# EAGLE design MDM_V3_Connectorx6_A (EAGLE 6.4)
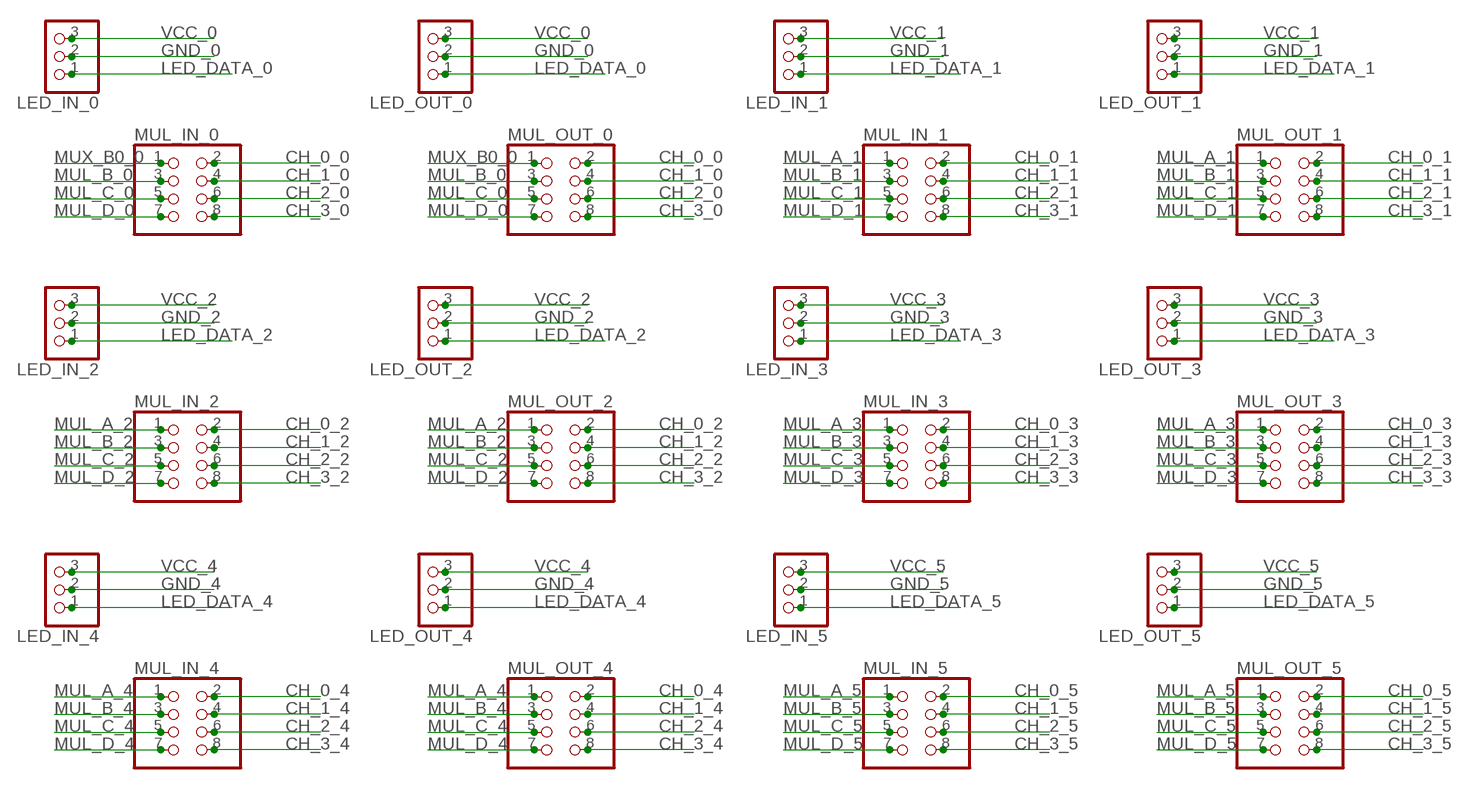
[diagram p0: schematic, sheet 1]

## Parts
LED_IN_0  PINHD-1X3  [1X03]
LED_IN_1  PINHD-1X3  [1X03]
LED_IN_2  PINHD-1X3  [1X03]
LED_IN_3  PINHD-1X3  [1X03]
LED_IN_4  PINHD-1X3  [1X03]
LED_IN_5  PINHD-1X3  [1X03]
LED_OUT_0  PINHD-1X3  [1X03]
LED_OUT_1  PINHD-1X3  [1X03]
LED_OUT_2  PINHD-1X3  [1X03]
LED_OUT_3  PINHD-1X3  [1X03]
LED_OUT_4  PINHD-1X3  [1X03]
LED_OUT_5  PINHD-1X3  [1X03]
MUL_IN_0  PINHD-2X4  [2X04]
MUL_IN_1  PINHD-2X4  [2X04]
MUL_IN_2  PINHD-2X4  [2X04]
MUL_IN_3  PINHD-2X4  [2X04]
MUL_IN_4  PINHD-2X4  [2X04]
MUL_IN_5  PINHD-2X4  [2X04]
MUL_OUT_0  PINHD-2X4  [2X04]
MUL_OUT_1  PINHD-2X4  [2X04]
MUL_OUT_2  PINHD-2X4  [2X04]
MUL_OUT_3  PINHD-2X4  [2X04]
MUL_OUT_4  PINHD-2X4  [2X04]
MUL_OUT_5  PINHD-2X4  [2X04]

## Nets
CH_0_0: MUL_IN_0.2 MUL_OUT_0.2
CH_0_1: MUL_IN_1.2 MUL_OUT_1.2
CH_0_2: MUL_IN_2.2 MUL_OUT_2.2
CH_0_3: MUL_IN_3.2 MUL_OUT_3.2
CH_0_4: MUL_IN_4.2 MUL_OUT_4.2
CH_0_5: MUL_IN_5.2 MUL_OUT_5.2
CH_1_0: MUL_IN_0.4 MUL_OUT_0.4
CH_1_1: MUL_IN_1.4 MUL_OUT_1.4
CH_1_2: MUL_IN_2.4 MUL_OUT_2.4
CH_1_3: MUL_IN_3.4 MUL_OUT_3.4
CH_1_4: MUL_IN_4.4 MUL_OUT_4.4
CH_1_5: MUL_IN_5.4 MUL_OUT_5.4
CH_2_0: MUL_IN_0.6 MUL_OUT_0.6
CH_2_1: MUL_IN_1.6 MUL_OUT_1.6
CH_2_2: MUL_IN_2.6 MUL_OUT_2.6
CH_2_3: MUL_IN_3.6 MUL_OUT_3.6
CH_2_4: MUL_IN_4.6 MUL_OUT_4.6
CH_2_5: MUL_IN_5.6 MUL_OUT_5.6
CH_3_0: MUL_IN_0.8 MUL_OUT_0.8
CH_3_1: MUL_IN_1.8 MUL_OUT_1.8
CH_3_2: MUL_IN_2.8 MUL_OUT_2.8
CH_3_3: MUL_IN_3.8 MUL_OUT_3.8
CH_3_4: MUL_IN_4.8 MUL_OUT_4.8
CH_3_5: MUL_IN_5.8 MUL_OUT_5.8
GND_0 [GND]: LED_IN_0.2 LED_OUT_0.2
GND_1 [GND]: LED_IN_1.2 LED_OUT_1.2
GND_2 [GND]: LED_IN_2.2 LED_OUT_2.2
GND_3 [GND]: LED_IN_3.2 LED_OUT_3.2
GND_4 [GND]: LED_IN_4.2 LED_OUT_4.2
GND_5 [GND]: LED_IN_5.2 LED_OUT_5.2
LED_DATA_0: LED_IN_0.1 LED_OUT_0.1
LED_DATA_1: LED_IN_1.1 LED_OUT_1.1
LED_DATA_2: LED_IN_2.1 LED_OUT_2.1
LED_DATA_3: LED_IN_3.1 LED_OUT_3.1
LED_DATA_4: LED_IN_4.1 LED_OUT_4.1
LED_DATA_5: LED_IN_5.1 LED_OUT_5.1
MUL_A_1: MUL_IN_1.1 MUL_OUT_1.1
MUL_A_2: MUL_IN_2.1 MUL_OUT_2.1
MUL_A_3: MUL_IN_3.1 MUL_OUT_3.1
MUL_A_4: MUL_IN_4.1 MUL_OUT_4.1
MUL_A_5: MUL_IN_5.1 MUL_OUT_5.1
MUL_B_0: MUL_IN_0.3 MUL_OUT_0.3
MUL_B_1: MUL_IN_1.3 MUL_OUT_1.3
MUL_B_2: MUL_IN_2.3 MUL_OUT_2.3
MUL_B_3: MUL_IN_3.3 MUL_OUT_3.3
MUL_B_4: MUL_IN_4.3 MUL_OUT_4.3
MUL_B_5: MUL_IN_5.3 MUL_OUT_5.3
MUL_C_0: MUL_IN_0.5 MUL_OUT_0.5
MUL_C_1: MUL_IN_1.5 MUL_OUT_1.5
MUL_C_2: MUL_IN_2.5 MUL_OUT_2.5
MUL_C_3: MUL_IN_3.5 MUL_OUT_3.5
MUL_C_4: MUL_IN_4.5 MUL_OUT_4.5
MUL_C_5: MUL_IN_5.5 MUL_OUT_5.5
MUL_D_0: MUL_IN_0.7 MUL_OUT_0.7
MUL_D_1: MUL_IN_1.7 MUL_OUT_1.7
MUL_D_2: MUL_IN_2.7 MUL_OUT_2.7
MUL_D_3: MUL_IN_3.7 MUL_OUT_3.7
MUL_D_4: MUL_IN_4.7 MUL_OUT_4.7
MUL_D_5: MUL_IN_5.7 MUL_OUT_5.7
MUX_B0_0: MUL_IN_0.1 MUL_OUT_0.1
VCC_0 [GND]: LED_IN_0.3 LED_OUT_0.3
VCC_1 [GND]: LED_IN_1.3 LED_OUT_1.3
VCC_2 [GND]: LED_IN_2.3 LED_OUT_2.3
VCC_3 [GND]: LED_IN_3.3 LED_OUT_3.3
VCC_4 [GND]: LED_IN_4.3 LED_OUT_4.3
VCC_5 [GND]: LED_IN_5.3 LED_OUT_5.3

## Library data of the parts
LED_IN_0 LED_IN_1-LED_IN_5 LED_OUT_0 LED_OUT_1-LED_OUT_5 = adafruit:PINHD-1X3: PIN HEADER
MUL_IN_0 MUL_IN_1-MUL_IN_5 MUL_OUT_0 MUL_OUT_1-MUL_OUT_5 = pinhead:PINHD-2X4: PIN HEADER

## Net classes
1 GND: width 0.762 mm, clearance 0.254 mm

## Board
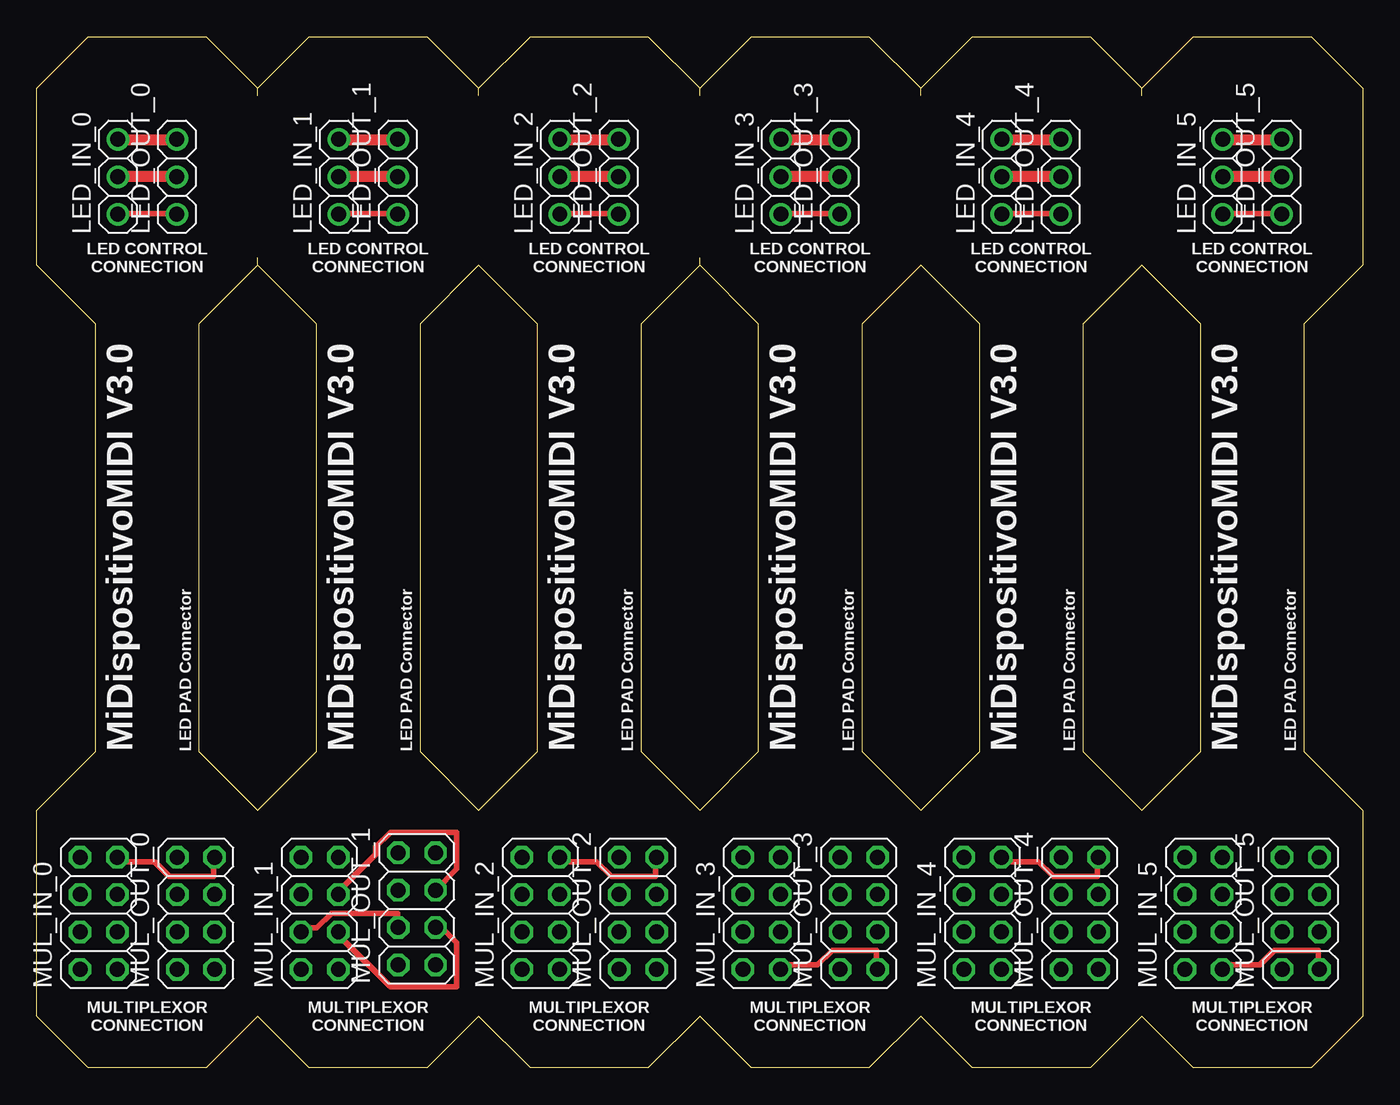
[diagram p1: board, top side]
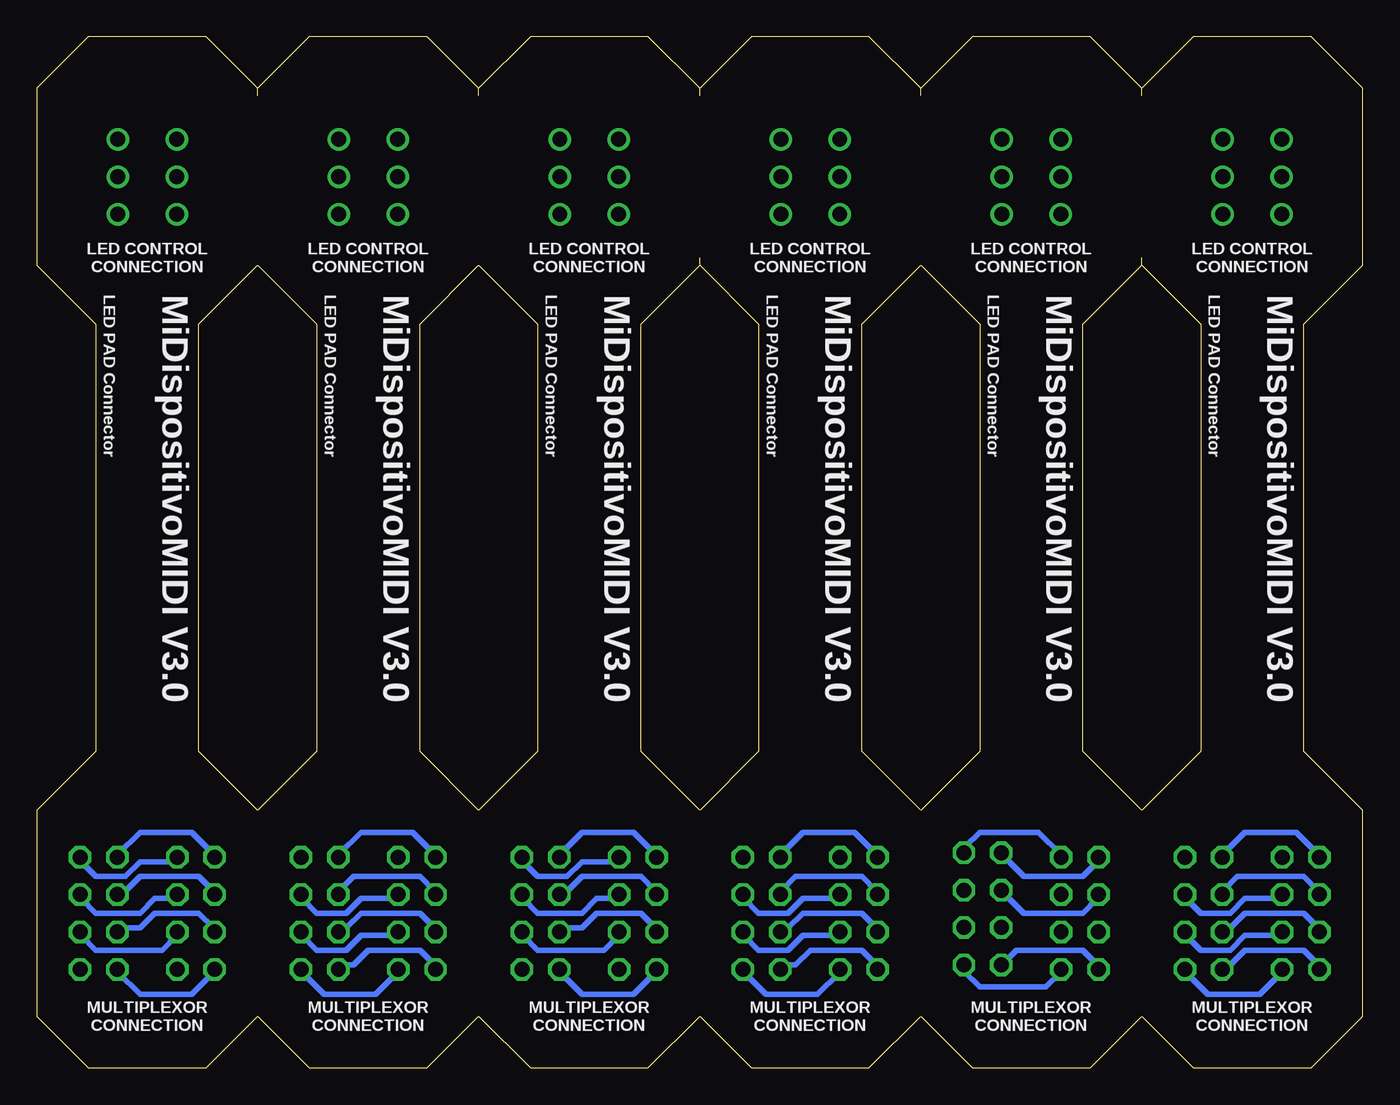
[diagram p2: board, bottom side, seen from below]

Size 90 x 70 mm. Coordinates in mm from the lower left corner, seen from the top.
Outline: 15,66.5 11.5,70 3.5,70 0,66.5 0,66 0,55 0,54.5 4,50.5 4,21.5 0,17.5 0,3.5 3.5,0 11.5,0 15,3.5 18.5,0 26.5,0 30,3.5 33.5,0 41.5,0 45,3.5 48.5,0 56.5,0 60,3.5 63.5,0 71.5,0 75,3.5 78.5,0 86.5,0 90,3.5 90,17.5 86,21.5 86,50.5 90,54.5 90,66.5 86.5,70 78.5,70 75,66.5
Outline: 15,54.5 11,50.5 11,21.5 15,17.5 19,21.5 19,50.5 15,54.5
Outline: 15,66 15,66.5
Outline: 15,66.5 18.5,70 26.5,70 30,66.5
Outline: 15,54.5 15,55
Outline: 30,66 30,66.5
Outline: 30,66.5 33.5,70 41.5,70 45,66.5
Outline: 45,54.5 41,50.5 41,21.5 45,17.5 49,21.5 49,50.5 45,54.5
Outline: 45,66 45,66.5
Outline: 45,66.5 48.5,70 56.5,70 60,66.5
Outline: 45,54.5 45,55
Outline: 60,66 60,66.5
Outline: 60,66.5 63.5,70 71.5,70 75,66.5
Outline: 75,66 75,66.5
Outline: 30,54.5 26,50.5 26,21.5 30,17.5 34,21.5 34,50.5 30,54.5
Outline: 60,54.5 56,50.5 56,21.5 60,17.5 64,21.5 64,50.5 60,54.5
Outline: 75,54.5 71,50.5 71,21.5 75,17.5 79,21.5 79,50.5 75,54.5
Copper layers (1*16): Top 0.035mm / dielectric 1.5mm / Bottom 0.035mm
Design rules "default *": minimum track width 15mil, minimum drill 24mil, track to track 10mil, track to pad 10mil, pad to pad 10mil, via to via 10mil, smd to smd 8mil, copper to edge 8mil, drill to drill 8mil, minimum pad ring 10mil, minimum via ring 10mil, stop-mask expansion 4mil, vias tented up to drill 0mil, thermal gap 10mil
tKeepout: area 2,5.5 to 6.5,15.5; area 8.5,5.5 to 13,15.5
tRestrict: 10 lines
bRestrict: 10 lines

### Footprints (pad centres in the part's own frame; a part is rotated, then mirrored left to right if it is on the bottom)
1X03 = drill 1.016: 1 -2.54,0; 2 0,0; 3 2.54,0
2X04 = drill 1.016 octagon: 1 -3.81,-1.27; 2 -3.81,1.27; 3 -1.27,-1.27; 4 -1.27,1.27; 5 1.27,-1.27; 6 1.27,1.27; 7 3.81,-1.27; 8 3.81,1.27

### Placement (x,y rotation side)
LED_IN_0  5.5,60.5 90 top
LED_IN_1  20.5,60.5 90 top
LED_IN_2  35.5,60.5 90 top
LED_IN_3  50.5,60.5 90 top
LED_IN_4  65.5,60.5 90 top
LED_IN_5  80.5,60.5 90 top
LED_OUT_0  9.5,60.5 90 top
LED_OUT_1  24.5,60.5 90 top
LED_OUT_2  39.5,60.5 90 top
LED_OUT_3  54.5,60.5 90 top
LED_OUT_4  69.5,60.5 90 top
LED_OUT_5  84.5,60.5 90 top
MUL_IN_0  4.2,10.5 90 top
MUL_IN_1  19.2,10.5 90 top
MUL_IN_2  34.2,10.5 90 top
MUL_IN_3  49.2,10.5 90 top
MUL_IN_4  64.2,10.5 90 top
MUL_IN_5  79.2,10.5 90 top
MUL_OUT_0  10.8,10.5 90 top
MUL_OUT_1  25.8,10.8 90 top
MUL_OUT_2  40.8,10.5 90 top
MUL_OUT_3  55.8,10.5 90 top
MUL_OUT_4  70.8,10.5 90 top
MUL_OUT_5  85.8,10.5 90 top

### Tracks (layer width: path | path; a pad name or v marks a point on that pad's centre or on a via)
CH_0_0
  Bottom 0.381: MUL_IN_0.2 3,7 4,8 8,8 9,7 9.5,7 MUL_OUT_0.2
CH_0_1
  Bottom 0.381: MUL_IN_1.2 18,7 19,8 23.5,8 24.5,7 MUL_OUT_1.2
CH_0_2
  Bottom 0.381: MUL_IN_2.2 33,7 34,8 37.5,8 38.5,7 39.5,7 MUL_OUT_2.2
CH_0_3
  Bottom 0.381: MUL_IN_3.2 48,6.5 49.5,5 53,5 54.5,6.5 MUL_OUT_3.2
CH_0_4
  Bottom 0.381: MUL_IN_4.2 63,7 64,8 67.5,8 68.5,7 69.5,7 MUL_OUT_4.2
CH_0_5
  Bottom 0.381: MUL_IN_5.2 78,6.5 79.5,5 83,5 84.5,6.5 MUL_OUT_5.2
CH_1_0
  Bottom 0.381: MUL_IN_0.4 3,9.5 4,10.5 8,10.5 9,9.5 9.5,9.5 MUL_OUT_0.4
CH_1_1
  Top 0.381: MUL_IN_1.4 18,9.5 19,9.5 20,10.5 24.5,10.5 24.5,10 MUL_OUT_1.4
CH_1_2
  Bottom 0.381: MUL_IN_2.4 33,9.5 34,10.5 38,10.5 39,9.5 39.5,9.5 MUL_OUT_2.4
CH_1_3
  Bottom 0.381: MUL_IN_3.4 48,9.5 49,10.5 52,10.5 53,9.5 54.5,9.5 MUL_OUT_3.4
CH_1_4
  Bottom 0.381: MUL_IN_4.4 63,9.5 64,10.5 68,10.5 69,9.5 69.5,9.5 MUL_OUT_4.4
CH_1_5
  Bottom 0.381: MUL_IN_5.4 78,9.5 79,10.5 82,10.5 83,9.5 84.5,9.5 MUL_OUT_5.4
CH_2_0
  Bottom 0.381: MUL_IN_0.6 3,12 4,13 8.5,13 9.5,12 MUL_OUT_0.6
CH_2_1
  Bottom 0.381: MUL_IN_1.6 18,11.5 19,10.5 23,10.5 24.5,12 MUL_OUT_1.6
CH_2_2
  Bottom 0.381: MUL_IN_2.6 33,12 34,13 38.5,13 39.5,12 MUL_OUT_2.6
CH_2_3
  Bottom 0.381: MUL_IN_3.6 48,12 49,13 53,13 54,12 54.5,12 MUL_OUT_3.6
CH_2_4
  Bottom 0.381: MUL_IN_4.6 63,12 64,13 68.5,13 69.5,12 MUL_OUT_4.6
CH_2_5
  Bottom 0.381: MUL_IN_5.6 78,12 79,13 83,13 84,12 84.5,12 MUL_OUT_5.6
CH_3_0
  Bottom 0.381: MUL_IN_0.8 3,14.5 4.5,16 8,16 9.5,14.5 MUL_OUT_0.8
CH_3_1
  Bottom 0.381: MUL_IN_1.8 18,14 19,13 23,13 24.5,14.5 MUL_OUT_1.8
CH_3_2
  Bottom 0.381: MUL_IN_2.8 33,14.5 34.5,16 38,16 39.5,14.5 MUL_OUT_2.8
CH_3_3
  Bottom 0.381: MUL_IN_3.8 48,14.5 49.5,16 53,16 54.5,14.5 MUL_OUT_3.8
CH_3_4
  Bottom 0.381: MUL_IN_4.8 63,14.5 64.5,16 68,16 69.5,14.5 MUL_OUT_4.8
CH_3_5
  Bottom 0.381: MUL_IN_5.8 78,14.5 79.5,16 83,16 84.5,14.5 MUL_OUT_5.8
GND_0
  Top 0.762: LED_OUT_0.2 LED_IN_0.2
GND_1
  Top 0.762: LED_OUT_1.2 LED_IN_1.2
GND_2
  Top 0.762: LED_OUT_2.2 LED_IN_2.2
GND_3
  Top 0.762: LED_OUT_3.2 LED_IN_3.2
GND_4
  Top 0.762: LED_OUT_4.2 LED_IN_4.2
GND_5
  Top 0.762: LED_OUT_5.2 LED_IN_5.2
LED_DATA_0
  Top 0.381: LED_IN_0.1 5.5,58 9.5,58 LED_OUT_0.1
LED_DATA_1
  Top 0.381: LED_IN_1.1 20.5,58 24.5,58 LED_OUT_1.1
LED_DATA_2
  Top 0.381: LED_IN_2.1 35.5,58 39.5,58 LED_OUT_2.1
LED_DATA_3
  Top 0.381: LED_IN_3.1 50.5,58 54.5,58 LED_OUT_3.1
LED_DATA_4
  Top 0.381: LED_IN_4.1 65.5,58 69.5,58 LED_OUT_4.1
LED_DATA_5
  Top 0.381: LED_IN_5.1 80.5,58 84.5,58 LED_OUT_5.1
MUL_A_1
  Bottom 0.381: MUL_IN_1.1 20.5,6.5 21.5,5.5 26,5.5 27,6.5 MUL_OUT_1.1
MUL_A_2
  Bottom 0.381: MUL_IN_2.1 35.5,6.5 37,5 40.5,5 42,6.5 MUL_OUT_2.1
MUL_A_3
  Top 0.381: MUL_IN_3.1 50.5,7 53,7 54,8 57,8 57,7 MUL_OUT_3.1
MUL_A_4
  Bottom 0.381: MUL_IN_4.1 65.5,6.5 67,5 70.5,5 72,6.5 MUL_OUT_4.1
MUL_A_5
  Top 0.381: MUL_IN_5.1 80.5,7 83,7 84,8 87,8 87,7 MUL_OUT_5.1
MUL_B_0
  Bottom 0.381: MUL_IN_0.3 5.5,9 8,9 9,8 11,8 12,9 MUL_OUT_0.3
MUL_B_1
  Top 0.381: MUL_IN_1.3 20.5,9 24,5.5 28.5,5.5 28.5,8.5 27.5,9.5 MUL_OUT_1.3
MUL_B_2
  Bottom 0.381: MUL_IN_2.3 35.5,9 38,9 39,8 41,8 42,9 MUL_OUT_2.3
MUL_B_3
  Bottom 0.381: MUL_IN_3.3 50.5,9 51.5,8 56,8 57,9 MUL_OUT_3.3
MUL_B_4
  Bottom 0.381: MUL_IN_4.3 65.5,9 68,9 69,8 71,8 72,9 MUL_OUT_4.3
MUL_B_5
  Bottom 0.381: MUL_IN_5.3 80.5,9 81.5,8 86,8 87,9 MUL_OUT_5.3
MUL_C_0
  Bottom 0.381: MUL_IN_0.5 5.5,11.5 8,11.5 9,10.5 11,10.5 12,11.5 MUL_OUT_0.5
MUL_C_1
  Top 0.381: MUL_OUT_1.5 28.5,13.5 28.5,16 24,16 23,15 23,14.5 20.5,12 MUL_IN_1.5
MUL_C_2
  Bottom 0.381: MUL_IN_2.5 35.5,11.5 38,11.5 39,10.5 41,10.5 42,11.5 MUL_OUT_2.5
MUL_C_3
  Bottom 0.381: MUL_IN_3.5 50.5,11.5 52,11.5 53,10.5 56,10.5 57,11.5 MUL_OUT_3.5
MUL_C_4
  Bottom 0.381: MUL_IN_4.5 65.5,11.5 68,11.5 69,10.5 71,10.5 72,11.5 MUL_OUT_4.5
MUL_C_5
  Bottom 0.381: MUL_IN_5.5 80.5,11.5 82,11.5 83,10.5 86,10.5 87,11.5 MUL_OUT_5.5
MUL_D_0
  Top 0.381: MUL_IN_0.7 5.5,14 8,14 9,13 12,13 12,14 MUL_OUT_0.7
MUL_D_1
  Bottom 0.381: MUL_IN_1.7 20.5,14.5 22,16 26,16 27,15 MUL_OUT_1.7
MUL_D_2
  Top 0.381: MUL_IN_2.7 35.5,14 38,14 39,13 42,13 42,14 MUL_OUT_2.7
MUL_D_3
  Bottom 0.381: MUL_IN_3.7 50.5,14 53,14 54,13 56,13 57,14 MUL_OUT_3.7
MUL_D_4
  Top 0.381: MUL_IN_4.7 65.5,14 68,14 69,13 72,13 72,14 MUL_OUT_4.7
MUL_D_5
  Bottom 0.381: MUL_IN_5.7 80.5,14 83,14 84,13 86,13 87,14 MUL_OUT_5.7
MUX_B0_0
  Bottom 0.381: MUL_IN_0.1 5.5,6.5 7,5 10.5,5 12,6.5 MUL_OUT_0.1
VCC_0
  Top 0.762: LED_IN_0.3 5.5,63 9.5,63 LED_OUT_0.3
VCC_1
  Top 0.762: LED_IN_1.3 20.5,63 24.5,63 LED_OUT_1.3
VCC_2
  Top 0.762: LED_IN_2.3 35.5,63 39.5,63 LED_OUT_2.3
VCC_3
  Top 0.762: LED_IN_3.3 50.5,63 54.5,63 LED_OUT_3.3
VCC_4
  Top 0.762: LED_IN_4.3 65.5,63 69.5,63 LED_OUT_4.3
VCC_5
  Top 0.762: LED_IN_5.3 80.5,63 84.5,63 LED_OUT_5.3

### Text on the board
_tsilk: LED CONTROL / CONNECTION | LED CONTROL / CONNECTION | LED CONTROL / CONNECTION | LED CONTROL / CONNECTION | LED CONTROL / CONNECTION | LED CONTROL / CONNECTION | MiDispositivoMIDI V3.0 | LED PAD Connector | MiDispositivoMIDI V3.0 | LED PAD Connector | MiDispositivoMIDI V3.0 | LED PAD Connector | MiDispositivoMIDI V3.0 | LED PAD Connector | MiDispositivoMIDI V3.0 | LED PAD Connector | MiDispositivoMIDI V3.0 | LED PAD Connector | MULTIPLEXOR / CONNECTION | MULTIPLEXOR / CONNECTION | MULTIPLEXOR / CONNECTION | MULTIPLEXOR / CONNECTION | MULTIPLEXOR / CONNECTION | MULTIPLEXOR / CONNECTION
_bsilk: LED CONTROL / CONNECTION | LED CONTROL / CONNECTION | LED CONTROL / CONNECTION | LED CONTROL / CONNECTION | LED CONTROL / CONNECTION | LED CONTROL / CONNECTION | MiDispositivoMIDI V3.0 | LED PAD Connector | MiDispositivoMIDI V3.0 | LED PAD Connector | MiDispositivoMIDI V3.0 | LED PAD Connector | MiDispositivoMIDI V3.0 | LED PAD Connector | MiDispositivoMIDI V3.0 | LED PAD Connector | MiDispositivoMIDI V3.0 | LED PAD Connector | MULTIPLEXOR / CONNECTION | MULTIPLEXOR / CONNECTION | MULTIPLEXOR / CONNECTION | MULTIPLEXOR / CONNECTION | MULTIPLEXOR / CONNECTION | MULTIPLEXOR / CONNECTION